# Altium project CompassIO_Project.PrjPcb
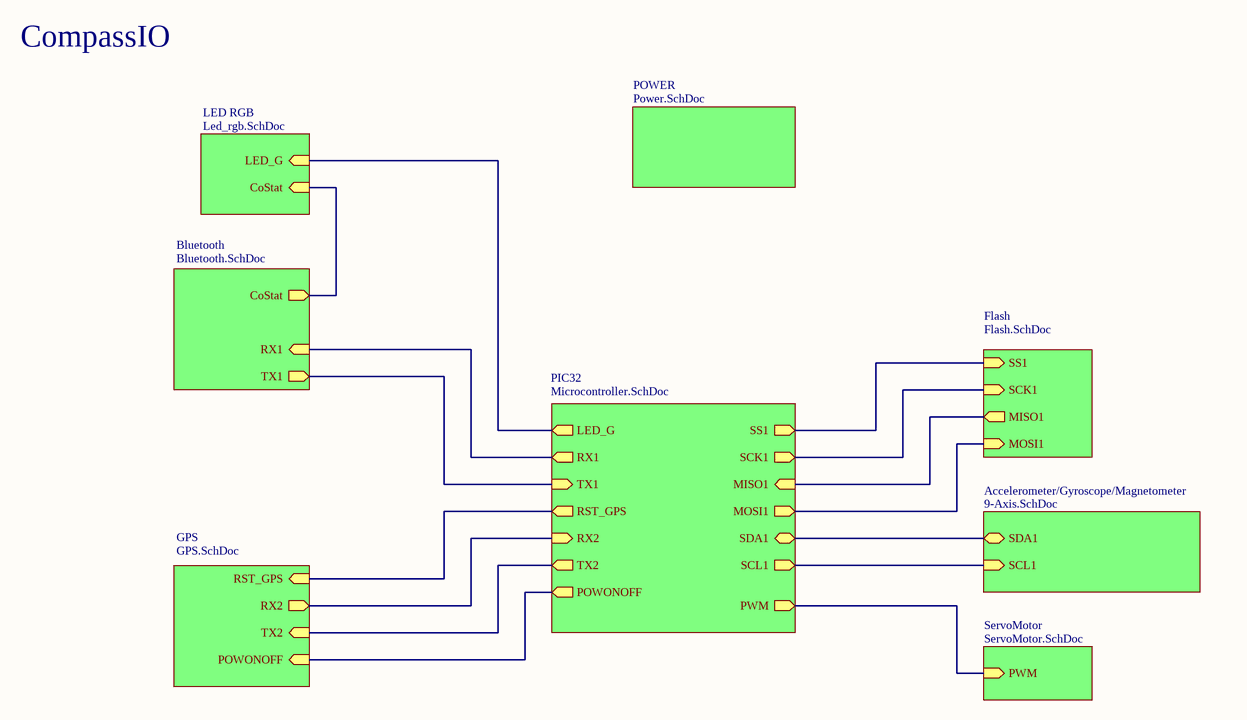
[diagram p0: CompassIO.SchDoc]
9 sheets, 70 parts. Net scope: hierarchical (ports join the sheet entries above them; power ports are global).
Board files: PCB1.PcbDoc, PCB2.PcbDoc
Sheets:
  CompassIO.SchDoc
    Bluetooth = Bluetooth.SchDoc
    PIC32 = Microcontroller.SchDoc
    GPS = GPS.SchDoc
    Accelerometer/Gyroscope/Magnetometer = 9-Axis.SchDoc
    Flash = Flash.SchDoc
    ServoMotor = ServoMotor.SchDoc
    LED RGB = Led_rgb.SchDoc
    POWER = Power.SchDoc

## Sheet CompassIO.SchDoc
size A4; SheetNumber: 0

### Sub-sheets
Accelerometer/Gyroscope/Magnetometer = 9-Axis.SchDoc: SDA1 (bidir), SCL1 (in)
Bluetooth = Bluetooth.SchDoc: CoStat (out), RX1 (in), TX1 (out)
Flash = Flash.SchDoc: SS1 (in), SCK1 (in), MISO1 (out), MOSI1 (in)
GPS = GPS.SchDoc: RST_GPS (in), TX2 (in), RX2 (out), POWONOFF (in)
LED RGB = Led_rgb.SchDoc: LED_G (in), CoStat (in)
PIC32 = Microcontroller.SchDoc: POWONOFF (out), RX2 (in), TX2 (out), RST_GPS (out), LED_G (out), RX1 (out), TX1 (in), SS1 (out), SCK1 (out), MISO1 (in), MOSI1 (out), SDA1 (bidir), PWM (out), SCL1 (out)
POWER = Power.SchDoc: no entries
ServoMotor = ServoMotor.SchDoc: PWM (in)

### Nets
NetJ1_13: sheet Bluetooth/TX1, sheet PIC32/TX1
NetJ1_14: sheet Bluetooth/RX1, sheet PIC32/RX1
NetJ1_21: sheet Bluetooth/CoStat, sheet LED RGB/CoStat
NetJ2_5: sheet PIC32/SCL1, sheet Accelerometer/Gyroscope/Magnetometer/SCL1
NetJ2_6: sheet PIC32/SDA1, sheet Accelerometer/Gyroscope/Magnetometer/SDA1
NetJ4_1: sheet PIC32/RST_GPS, sheet GPS/RST_GPS
NetJ4_18: sheet PIC32/POWONOFF, sheet GPS/POWONOFF
NetJ4_20: sheet PIC32/RX2, sheet GPS/RX2
NetJ4_21: sheet PIC32/TX2, sheet GPS/TX2
NetQ1_2: sheet PIC32/PWM, sheet ServoMotor/PWM
NetR9_2: sheet PIC32/LED_G, sheet LED RGB/LED_G
NetU1_22: sheet PIC32/MISO1, sheet Flash/MISO1
NetU1_24: sheet PIC32/MOSI1, sheet Flash/MOSI1
NetU1_25: sheet PIC32/SCK1, sheet Flash/SCK1
NetU1_26: sheet PIC32/SS1, sheet Flash/SS1

### Notes on the sheet
- CompassIO

## Sheet Bluetooth.SchDoc
size A4; SheetNumber: 3
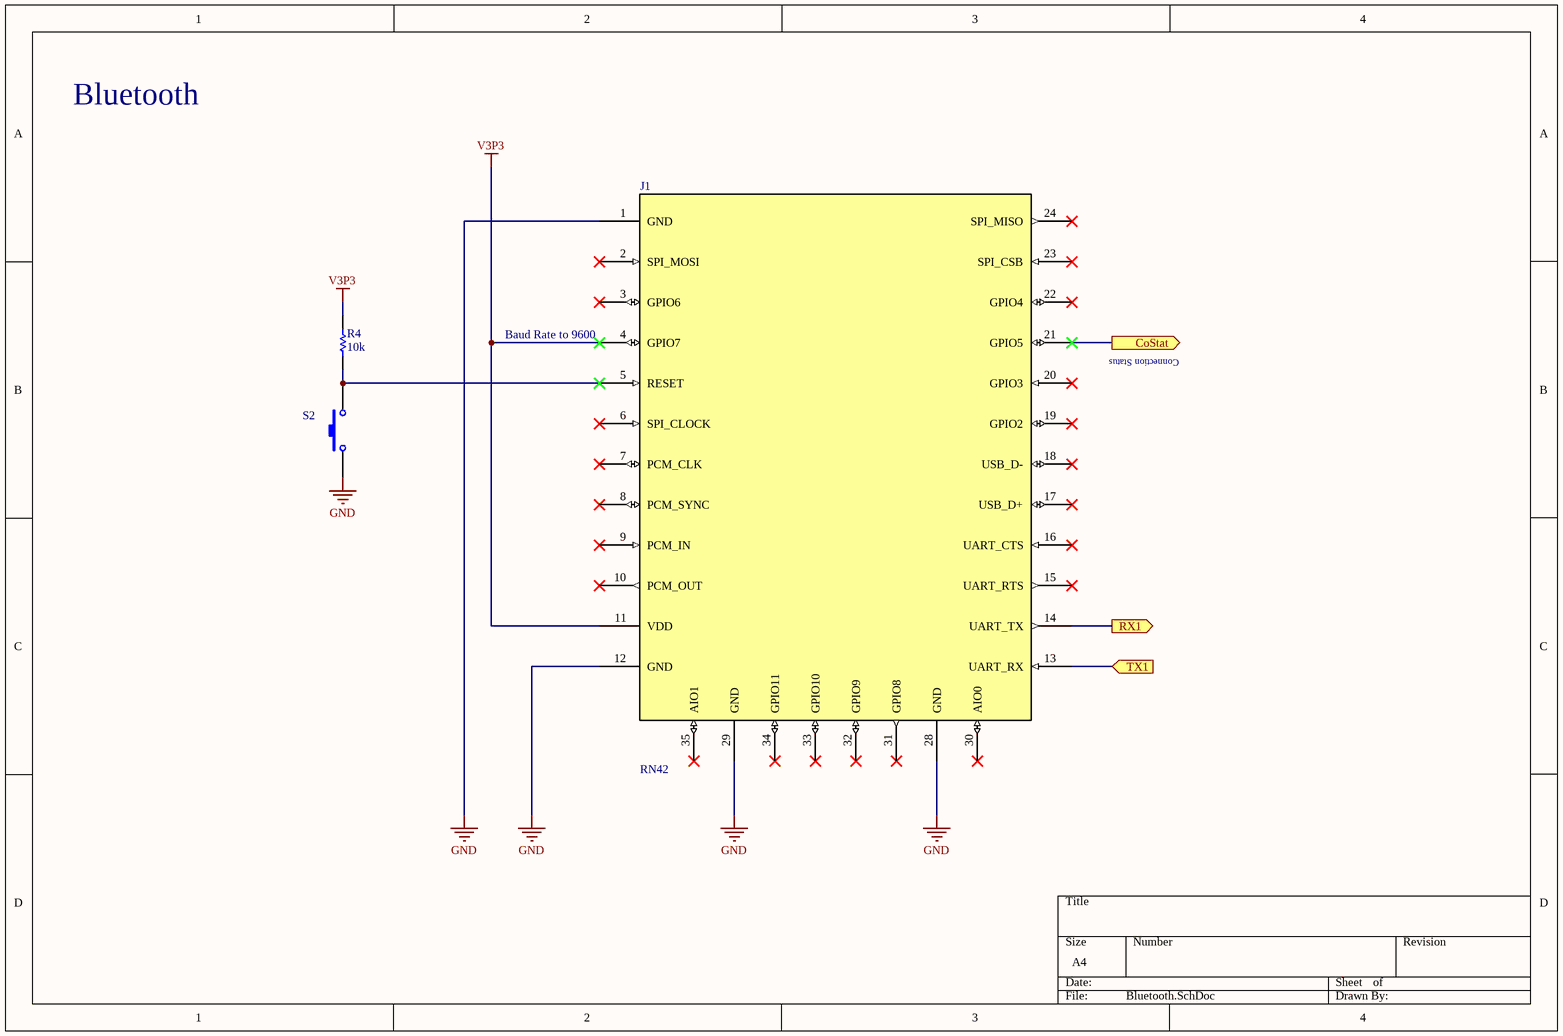
[diagram p1: Bluetooth.SchDoc]

### Parts
J1  RN42  [RN42]
R4  10k  [own_0603]
S2  Switch  [DPST-4]  (value not drawn)

### Ports
CoStat (out), RX1 (out), TX1 (in)

### Nets
GND: J1.1(GND) J1.12(GND) J1.28(GND) J1.29(GND) S2.1
V3P3: J1.4(GPIO7) J1.11(VDD) R4.2
NetJ1_5: J1.5(RESET) R4.1 S2.2
NetJ1_13: J1.13(UART_RX) ; port TX1
NetJ1_14: J1.14(UART_TX) ; port RX1
NetJ1_21: J1.21(GPIO5) ; port CoStat

Not connected (* = marked no-connect by the designer): J1 2(SPI_MOSI)* 3(GPIO6)* 6(SPI_CLOCK)* 7(PCM_CLK)* 8(PCM_SYNC)* 9(PCM_IN)* 10(PCM_OUT)* 15(UART_RTS)* 16(UART_CTS)* 17(USB_D+)* 18(USB_D-)* 19(GPIO2)* 20(GPIO3)* 22(GPIO4)* 23(SPI_CSB)* 24(SPI_MISO)* 30(AIO0)* 31(GPIO8)* 32(GPIO9)* 33(GPIO10)* 34(GPIO11)* 35(AIO1)*

### Notes on the sheet
- Bluetooth
- (near J1) Baud Rate to 9600
- Connection Status

### Library data of the parts
J1 = RN42: Bluetooth Module; Fabricant: Microchip; RefFabricant: RN42-I/RM; Fournisseur: Farnell; RefFournisseur: 2143310
R4 = Res1: Resistor; Published: 8-Jun-2000; LatestRevisionDate: 17-Jul-2002; LatestRevisionNote: Re-released for DXP Platform.; PackageReference: AXIAL-0.3; Publisher: Altium Limited; PackageDescription: Axial Device, Thru-Hole; 2 Leads; 0.3 in Pin Spacing
S2 = SW-PB: Reset; Published: 24-Mar-1999; LatestRevisionDate: 17-Jul-2002; LatestRevisionNote: Re-released for DXP Platform.; PackageReference: SPST-2; Publisher: Altium Limited; PackageDescription: Switch; 2 Leads

## Sheet Microcontroller.SchDoc
size A4; SheetNumber: 1
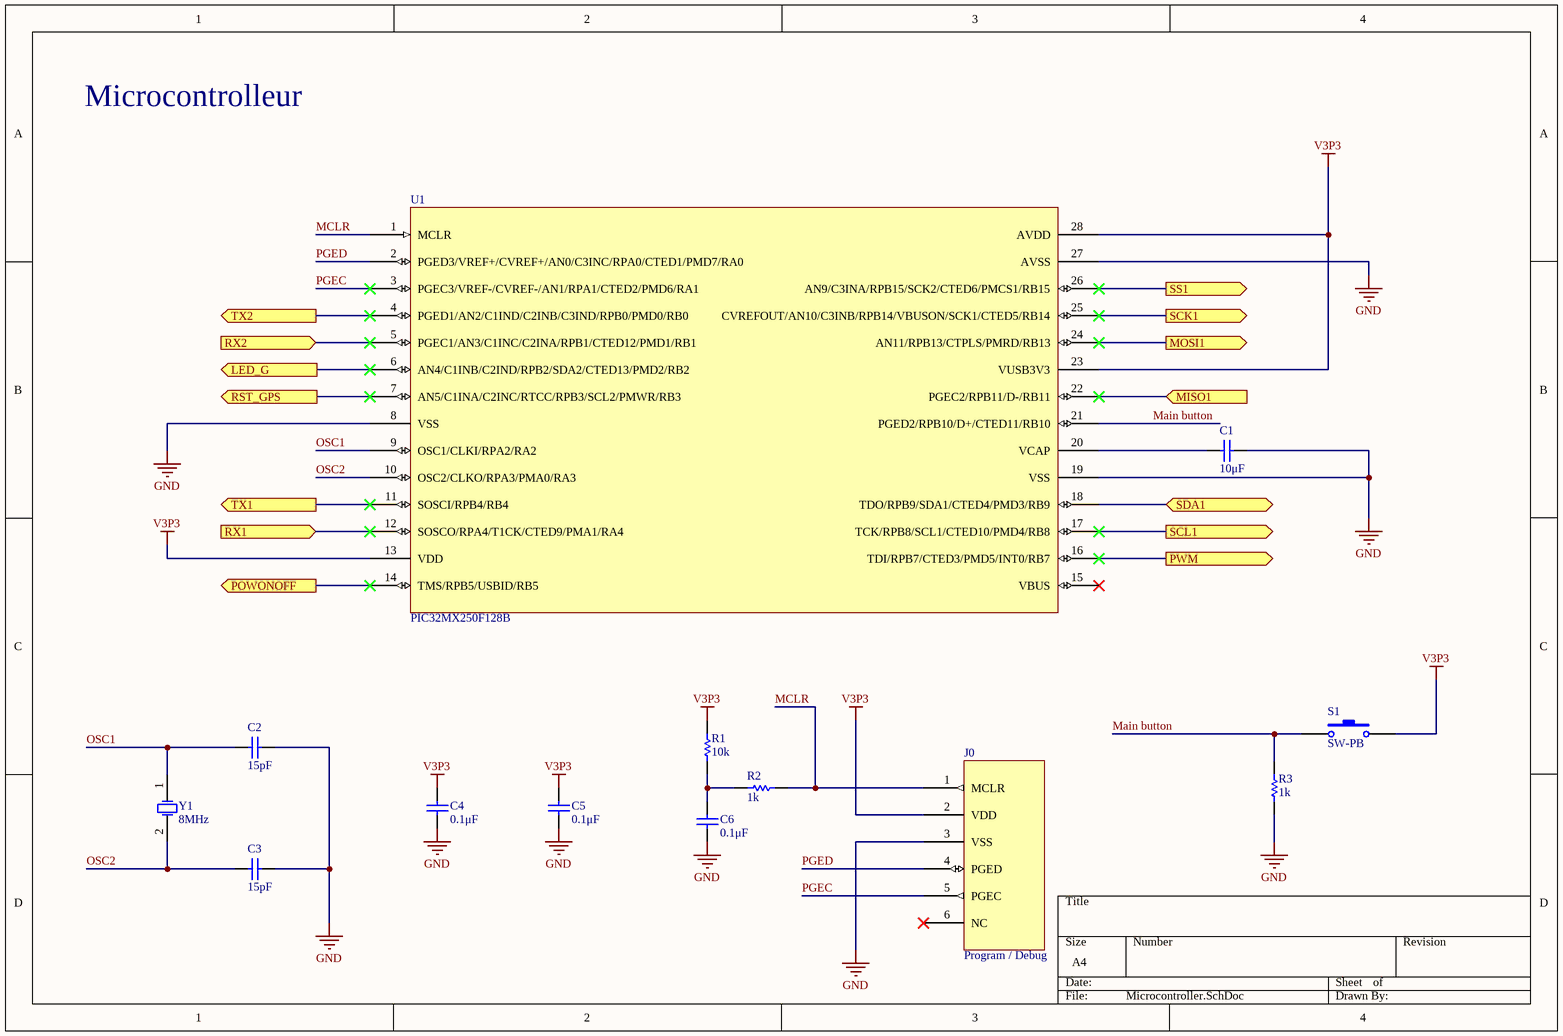
[diagram p2: Microcontroller.SchDoc]

### Parts
C1  10μF  [own_0603]
C2  15pF  [own_0603]
C3  15pF  [own_0603]
C4  0.1μF  [own_0603]
C5  0.1μF  [own_0603]
C6  0.1μF  [own_0603]
J0  Program / Debug  [C-Grid III X6]
R1  10k  [own_0603]
R2  1k  [own_0603]
R3  1k  [own_0603]
S1  SW-PB  [SPST-2]
U1  PIC32MX250F128B  [PIC32MX250F128/SO]
Y1  8MHz  [9B-8.000MAAJ-B]

### Ports
LED_G (out), MISO1 (in), MOSI1 (out), POWONOFF (out), PWM (out), RST_GPS (out), RX1 (in), RX2 (in), SCK1 (out), SCL1 (out), SDA1 (bidir), SS1 (out), TX1 (out), TX2 (out)

### Nets
GND: C1.1 C2.2 C3.2 C4.1 C5.1 C6.1 J0.3(VSS) R3.2 U1.8(VSS) U1.19(VSS) U1.27(AVSS)
V3P3: C4.2 C5.2 J0.2(VDD) R1.1 S1.2 U1.13(VDD) U1.23(VUSB3V3) U1.28(AVDD)
Main button: R3.1 S1.1 U1.21(PGED2/RPB10/D+/CTED11/RB10)
MCLR: J0.1(MCLR) R2.1 U1.1(MCLR)
OSC1: C2.1 U1.9(OSC1/CLKI/RPA2/RA2) Y1.1(OSC1)
OSC2: C3.1 U1.10(OSC2/CLKO/RPA3/PMA0/RA3) Y1.2(OSC2)
PGEC: J0.5(PGEC) U1.3(PGEC3/VREF-/CVREF-/AN1/RPA1/CTED2/PMD6/RA1)
PGED: J0.4(PGED) U1.2(PGED3/VREF+/CVREF+/AN0/C3INC/RPA0/CTED1/PMD7/RA0)
NetC1_2: C1.2 U1.20(VCAP)
NetC6_2: C6.2 R1.2 R2.2
NetJ1_13: U1.11(SOSCI/RPB4/RB4) ; port TX1
NetJ1_14: U1.12(SOSCO/RPA4/T1CK/CTED9/PMA1/RA4) ; port RX1
NetJ2_5: U1.17(TCK/RPB8/SCL1/CTED10/PMD4/RB8) ; port SCL1
NetJ2_6: U1.18(TDO/RPB9/SDA1/CTED4/PMD3/RB9) ; port SDA1
NetJ4_1: U1.7(AN5/C1INA/C2INC/RTCC/RPB3/SCL2/PMWR/RB3) ; port RST_GPS
NetJ4_18: U1.14(TMS/RPB5/USBID/RB5) ; port POWONOFF
NetJ4_20: U1.5(PGEC1/AN3/C1INC/C2INA/RPB1/CTED12/PMD1/RB1) ; port RX2
NetJ4_21: U1.4(PGED1/AN2/C1IND/C2INB/C3IND/RPB0/PMD0/RB0) ; port TX2
NetQ1_2: U1.16(TDI/RPB7/CTED3/PMD5/INT0/RB7) ; port PWM
NetR9_2: U1.6(AN4/C1INB/C2IND/RPB2/SDA2/CTED13/PMD2/RB2) ; port LED_G
NetU1_22: U1.22(PGEC2/RPB11/D-/RB11) ; port MISO1
NetU1_24: U1.24(AN11/RPB13/CTPLS/PMRD/RB13) ; port MOSI1
NetU1_25: U1.25(CVREFOUT/AN10/C3INB/RPB14/VBUSON/SCK1/CTED5/RB14) ; port SCK1
NetU1_26: U1.26(AN9/C3INA/RPB15/SCK2/CTED6/PMCS1/RB15) ; port SS1

Not connected (* = marked no-connect by the designer): J0 6(NC)*; U1 15(VBUS)*

### Notes on the sheet
- Microcontrolleur

### Library data of the parts
C1-C6 = Cap: Capacitor; Published: 8-Jun-2000; LatestRevisionDate: 17-Jul-2002; LatestRevisionNote: Re-released for DXP Platform.; PackageReference: RAD-0.3; Publisher: Altium Limited; PackageDescription: Radial Cap, Thru-Hole; 2 Leads; 0.3 in Pin Spacing
  C1: Value: 10μF
  C2 C3: Value: 15pF
  C4-C6: Value: 0.1μF
J0 = ICSP: Fabricant: Molex; RefFabricant: 90120-0126; Fournisseur: Farnell; RefFournisseur: 2313717
R1-R3 = Res1: Resistor; Published: 8-Jun-2000; LatestRevisionDate: 17-Jul-2002; LatestRevisionNote: Re-released for DXP Platform.; PackageReference: AXIAL-0.3; Publisher: Altium Limited; PackageDescription: Axial Device, Thru-Hole; 2 Leads; 0.3 in Pin Spacing
  R1: Value: 10k
  R2 R3: Value: 1k
S1 = SW-PB: Switch
U1 = PIC32MX250F128B: Microcontrolleur; Fabricant: Microchip; RefFabricant: PIC32MX250F128B-I/SO; Fournisseur: Farnell; RefFournisseur: 2097772
Y1 = XTAL: Crystal Oscillator; Fabricant: TXC; Fournisseur: Farnell; RefFournisseur: 1842268; RefFabricant: 9B-8.000MAAJ-B

## Sheet GPS.SchDoc
size A4; SheetNumber: 4
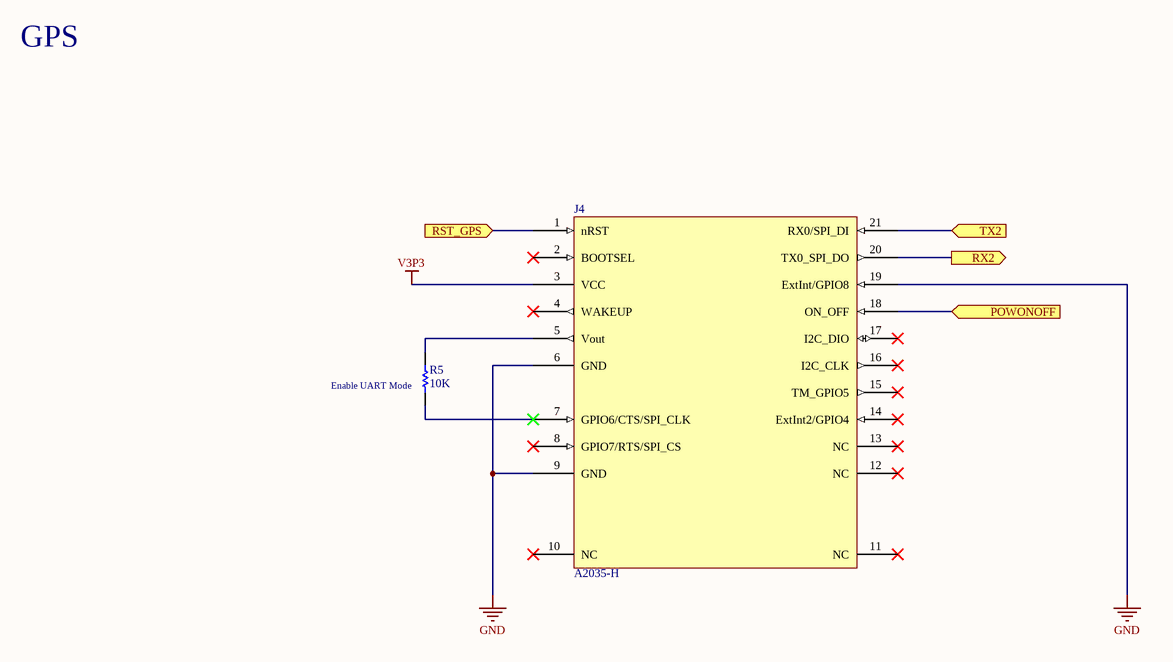
[diagram p3: GPS.SchDoc]

### Parts
J4  A2035-H  [A2035-H]
R5  10K  [own_0603]

### Ports
POWONOFF (in), RST_GPS (in), RX2 (out), TX2 (in)

### Nets
GND: J4.6(GND) J4.9(GND) J4.19(ExtInt/GPIO8)
V3P3: J4.3(VCC)
NetJ4_1: J4.1(nRST) ; port RST_GPS
NetJ4_5: J4.5(Vout) R5.2
NetJ4_7: J4.7(GPIO6/CTS/SPI_CLK) R5.1
NetJ4_18: J4.18(ON_OFF) ; port POWONOFF
NetJ4_20: J4.20(TX0_SPI_DO) ; port RX2
NetJ4_21: J4.21(RX0/SPI_DI) ; port TX2

Not connected (* = marked no-connect by the designer): J4 2(BOOTSEL)* 4(WAKEUP)* 8(GPIO7/RTS/SPI_CS)* 10(NC)* 11(NC)* 12(NC)* 13(NC)* 14(ExtInt2/GPIO4)* 15(TM_GPIO5)* 16(I2C_CLK)* 17(I2C_DIO)*

### Notes on the sheet
- GPS
- (near R5) Enable UART Mode

### Library data of the parts
J4 = A2035-H: GPS Module; Fabricant: MAESTRO WIRELESS SOLUTIONS; RefFabricant: A2035H; Fournisseur: Farnell; RefFournisseur: 2281693
R5 = Res1: Resistor; Published: 8-Jun-2000; LatestRevisionDate: 17-Jul-2002; LatestRevisionNote: Re-released for DXP Platform.; PackageReference: AXIAL-0.3; Publisher: Altium Limited; PackageDescription: Axial Device, Thru-Hole; 2 Leads; 0.3 in Pin Spacing

## Sheet 9-Axis.SchDoc
size A4; SheetNumber: 2
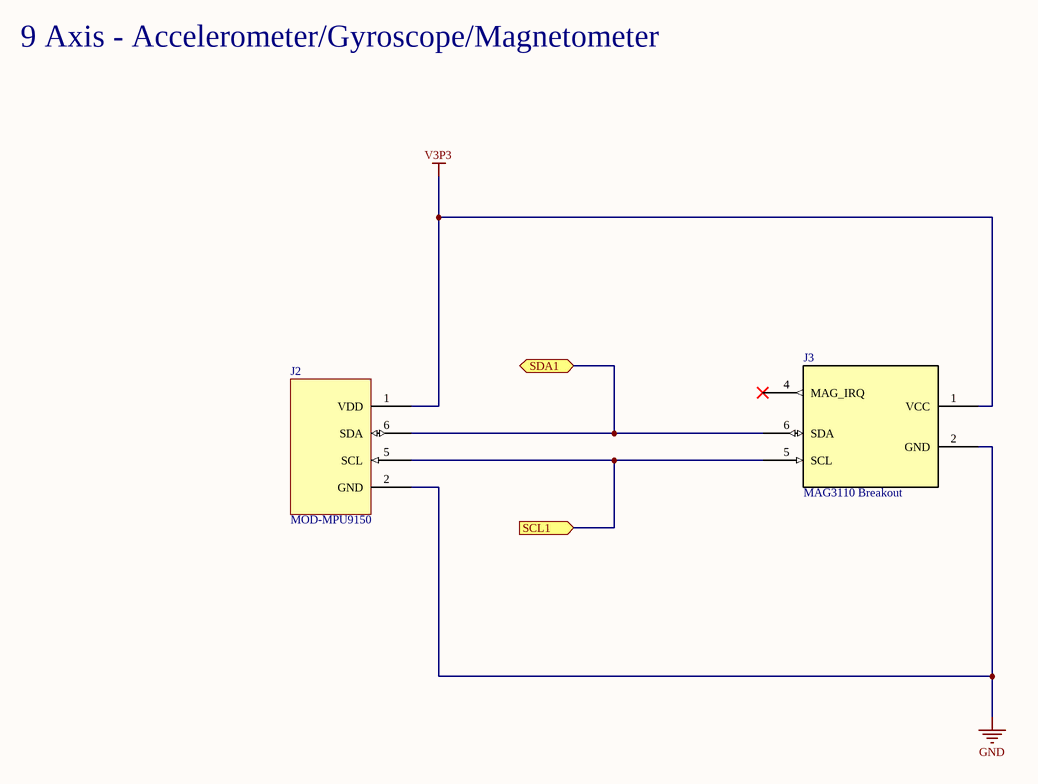
[diagram p4: 9-Axis.SchDoc]

### Parts
J2  MOD-MPU9150  [UEXT_MALE x10]
J3  MAG3110 Breakout  [UEXT_MALE x10]

### Ports
SCL1 (in), SDA1 (bidir)

### Nets
GND: J2.2(GND) J3.2(GND)
V3P3: J2.1(VDD) J3.1(VCC)
NetJ2_5: J2.5(SCL) J3.5(SCL) ; port SCL1
NetJ2_6: J2.6(SDA) J3.6(SDA) ; port SDA1

Not connected (* = marked no-connect by the designer): J3 4(MAG_IRQ)*

### Notes on the sheet
- 9 Axis - Accelerometer/Gyroscope/Magnetometer

### Library data of the parts
J2 = MOD-MPU9150: 9-Axis; Fabricant: AMP - TE Connectivy; RefFabricant: 5103310-1; Fournisseur: Farnell; RefFournisseur: 2452436
J3 = MOD-MAG3110: Fournisseur: Farnell; RefFabricant: 5103310-1; Fabricant: AMP - TE Connectvity; RefFournisseur: 2452436

## Sheet Flash.SchDoc
size A4; SheetNumber: 5
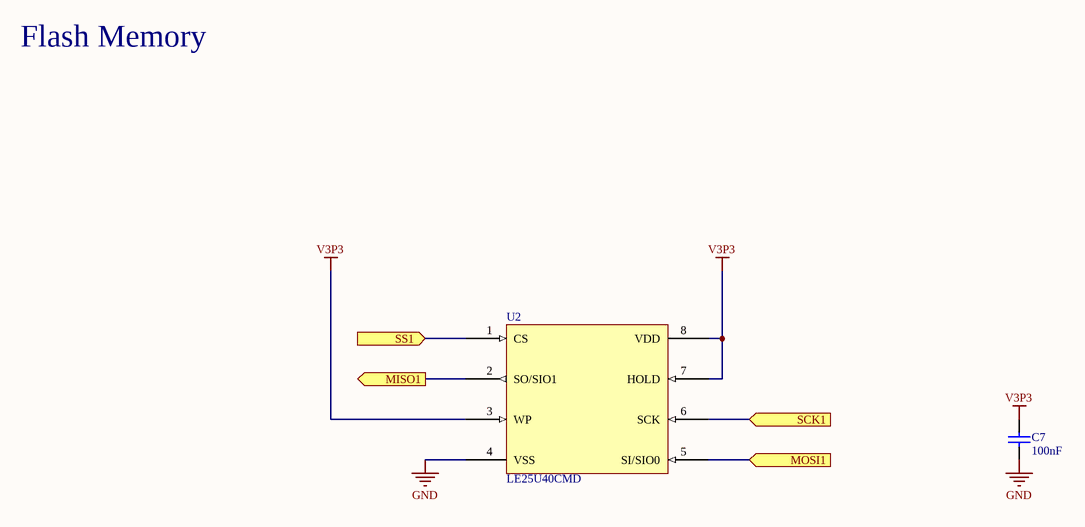
[diagram p5: Flash.SchDoc]

### Parts
C7  100nF  [own_0603]
U2  LE25U40CMD  [LE25U40CMDTWG]

### Ports
MISO1 (out), MOSI1 (in), SCK1 (in), SS1 (in)

### Nets
GND: C7.1 U2.4(VSS)
V3P3: C7.2 U2.3(WP) U2.7(HOLD) U2.8(VDD)
NetU1_22: U2.2(SO/SIO1) ; port MISO1
NetU1_24: U2.5(SI/SIO0) ; port MOSI1
NetU1_25: U2.6(SCK) ; port SCK1
NetU1_26: U2.1(CS) ; port SS1

### Notes on the sheet
- Flash Memory

### Library data of the parts
C7 = Cap: Capacitor; Value: 100pF; Published: 8-Jun-2000; LatestRevisionDate: 17-Jul-2002; LatestRevisionNote: Re-released for DXP Platform.; PackageReference: RAD-0.3; Publisher: Altium Limited; PackageDescription: Radial Cap, Thru-Hole; 2 Leads; 0.3 in Pin Spacing
U2 = LE25U40CMD: Flash memory; Fabricant: On Semiconductor; Fournisseur: Farnell; RefFournisseur: 2627898; RefFabricant: LE25U40CMDTWG

## Sheet ServoMotor.SchDoc
size A4; SheetNumber: 7
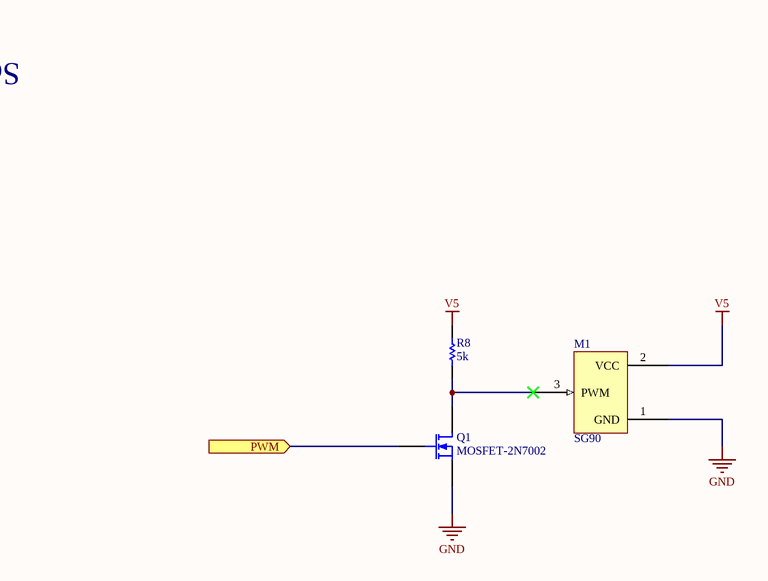
[diagram p6: ServoMotor.SchDoc]

### Parts
M1  SG90  [C-Grid III x3]
Q1  MOSFET-2N7002  [2N7002]
R8  5k  [own_0603]

### Ports
PWM (in)

### Nets
GND: M1.1(GND) Q1.3(S)
V5: M1.2(VCC) R8.2
NetM1_3: M1.3(PWM) Q1.1(D) R8.1
NetQ1_2: Q1.2(G) ; port PWM

### Notes on the sheet
- Servomotor

### Library data of the parts
M1 = SG90: Servo motor; Fabricant: Molex; Fournisseur: Farnell; RefFournisseur: 9731156; RefFabricant: 22-27-2031
Q1 = MOSFET-N: N-Channel MOSFET; Fabricant: ON SEMICONDUCTOR; Fournisseur: Farnell; RefFournisseur: 9845313; RefFabricant: 2N7002
R8 = Res1: Resistor; Published: 8-Jun-2000; LatestRevisionDate: 17-Jul-2002; LatestRevisionNote: Re-released for DXP Platform.; PackageReference: AXIAL-0.3; Publisher: Altium Limited; PackageDescription: Axial Device, Thru-Hole; 2 Leads; 0.3 in Pin Spacing

## Sheet Led_rgb.SchDoc
size A4; SheetNumber: 6
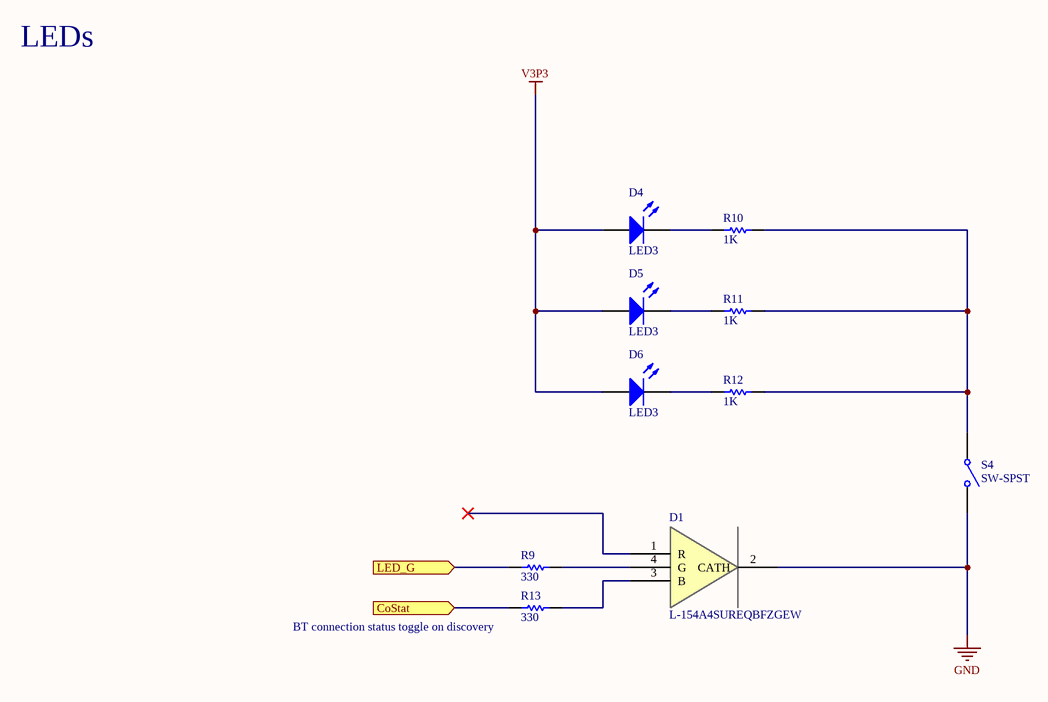
[diagram p7: Led_rgb.SchDoc]

### Parts
D1  L-154A4SUREQBFZGEW  [L-154A4SUREQBFZGEW]
D4  LED3  [LED2.5]
D5  LED3  [LED2.5]
D6  LED3  [LED2.5]
R9  330  [own_0603]
R10  1K  [own_0603]
R11  1K  [own_0603]
R12  1K  [own_0603]
R13  330  [own_0603]
S4  SW-SPST  [SPST-2]

### Ports
CoStat (in), LED_G (in)

### Nets
GND: D1.2(CATH) S4.2(NO)
V3P3: D4.1(A) D5.1(A) D6.1(A)
NetD1_3: D1.3(B) R13.1
NetD1_4: D1.4(G) R9.1
NetD4_2: D4.2(K) R10.1
NetD5_2: D5.2(K) R11.1
NetD6_2: D6.2(K) R12.1
NetJ1_21: R13.2 ; port CoStat
NetR9_2: R9.2 ; port LED_G
NetR10_2: R10.2 R11.2 R12.2 S4.1(COMMON)

Not connected (* = marked no-connect by the designer): D1 1(R)*

### Notes on the sheet
- LEDs
- (near R13) BT connection status toggle on discovery

### Library data of the parts
D1 = L-154A4SUREQBFZGEW: LED RGB; Fabricant: Kingbright; Fournisseur: Farnell; RefFournisseur: 2290375; RefFabricant: L-154A4SUREQBFZGEW
D4-D6 = LED3: Typical BLUE SiC LED; Fabricant: MULTICOMP; RefFabricant: MCL034SWC-WH1; Fournisseur: Farnell; RefFournisseur: 1581176
R9-R13 = Res1: Resistor; Published: 8-Jun-2000; LatestRevisionDate: 17-Jul-2002; LatestRevisionNote: Re-released for DXP Platform.; PackageReference: AXIAL-0.3; Publisher: Altium Limited; PackageDescription: Axial Device, Thru-Hole; 2 Leads; 0.3 in Pin Spacing
  R9 R13: Value: 330
  R10-R12: Value: 1K
S4 = SW-SPST: Single-Pole, Single-Throw Switch

## Sheet Power.SchDoc
size A4; SheetNumber: 8
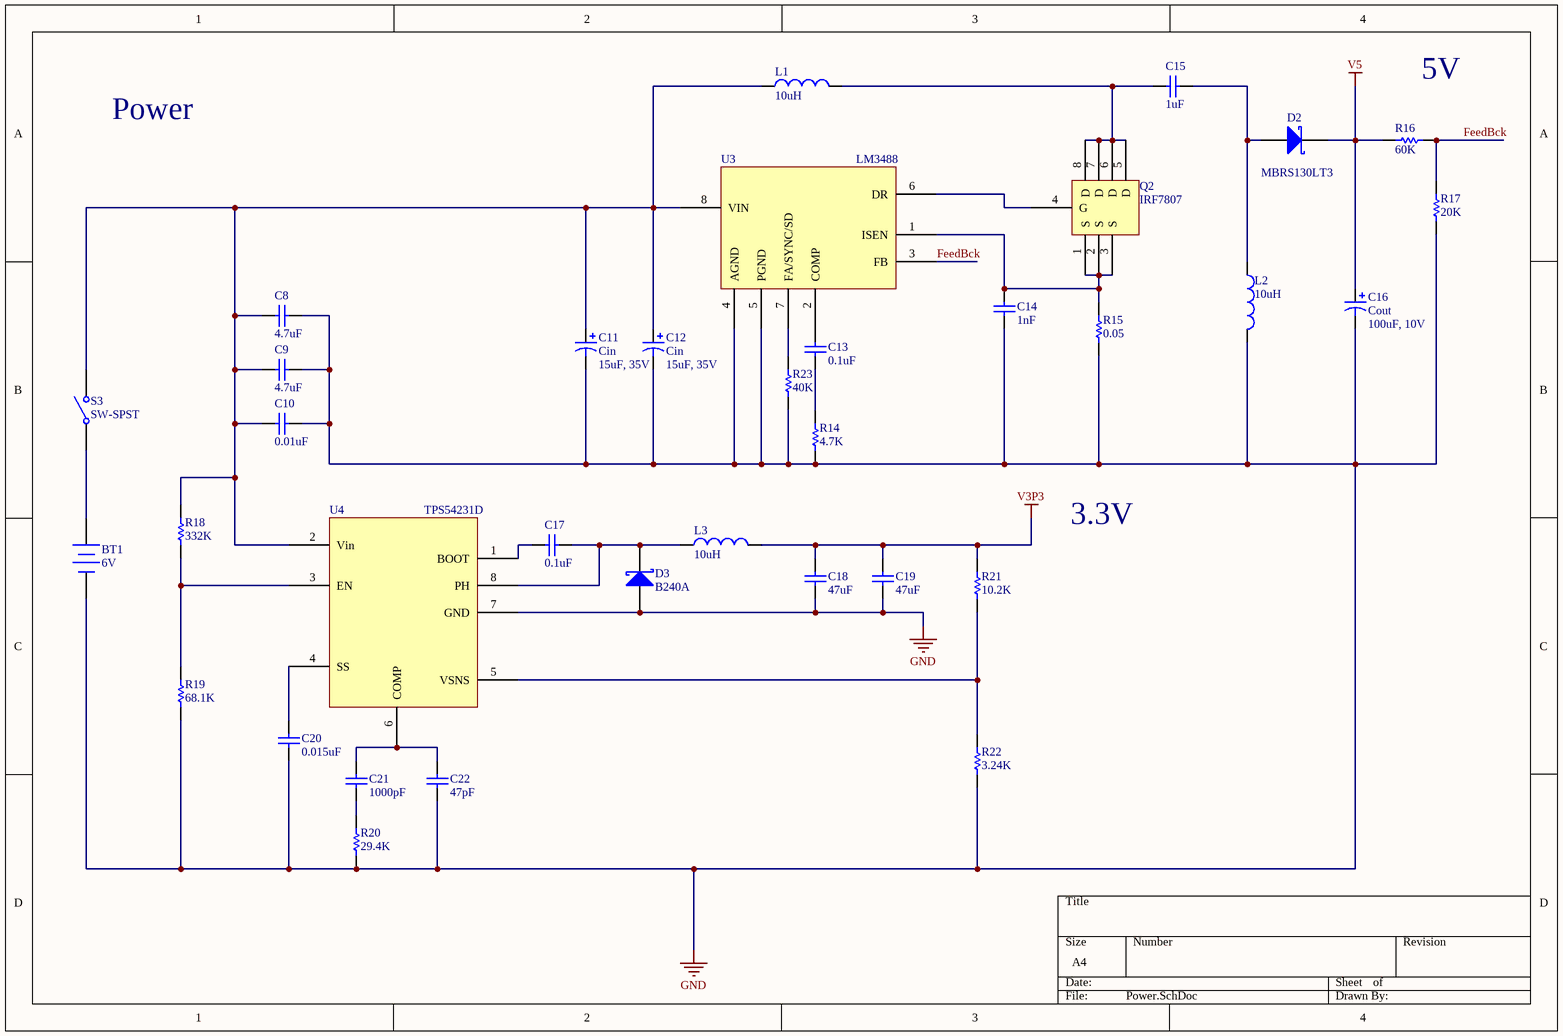
[diagram p8: Power.SchDoc]

### Parts
BT1  6V  [BAT-2]
C8  4.7uF  [own_0603]
C9  4.7uF  [own_0603]
C10  0.01uF  [own_0603]
C11  Cin  value 15uF, 35V  [WE-865080542005]
C12  Cin  value 15uF, 35V  [WE-865080542005]
C13  0.1uF  [own_0603]
C14  1nF  [own_0603]
C15  1uF  [own_0603]
C16  Cout  value 100uF, 10V  [SMT-HA-V-D]
C17  0.1uF  [own_0603]
C18  47uF  [own_0603]
C19  47uF  [own_0603]
C20  0.015uF  [own_0603]
C21  1000pF  [own_0603]
C22  47pF  [own_0603]
D2  MBRS130LT3  [SMB-403A-03-J]
D3  B240A  [SMA-B2XX/A]
L1  10uH  [RLB Series]
L2  10uH  [RLB Series]
L3  10uH  [RLB Series]
Q2  IRF7807  [SO-8]
R14  4.7K  [own_0603]
R15  0.05  [own_0603]
R16  60K  [own_0603]
R17  20K  [own_0603]
R18  332K  [own_0603]
R19  68.1K  [own_0603]
R20  29.4K  [own_0603]
R21  10.2K  [own_0603]
R22  3.24K  [own_0603]
R23  40K  [own_0603]
S3  SW-SPST  [SPST-2]
U3  LM3488  [S-PDSO-G8]
U4  TPS54231D  [R-PDSO-G8]

### Nets
GND: BT1.2(-) C8.2 C9.2 C10.2 C11.2 C12.2 C14.1 C16.2 C18.1 C19.1 C20.1 C22.1 D3.2(A) L2.2 R14.1 R15.1 R17.2 R19.2 R20.2 R22.2 R23.2 U3.4(AGND) U3.5(PGND) U4.7(GND)
V3P3: C18.2 C19.2 L3.2 R21.1
V5: C16.1 D2.1(K) R16.2
FeedBck: R16.1 R17.1 U3.3(FB)
NetBT1_1: BT1.1(+) S3.1(COMMON)
NetC8_1: C8.1 C9.1 C10.1 C11.1 C12.1 L1.1 R18.1 S3.2(NO) U3.8(VIN) U4.2(Vin)
NetC13_1: C13.1 R14.2
NetC13_2: C13.2 U3.2(COMP)
NetC14_2: C14.2 Q2.1(S) Q2.2(S) Q2.3(S) R15.2 U3.1(ISEN)
NetC15_1: C15.1 D2.2(A) L2.1
NetC15_2: C15.2 L1.2 Q2.5(D) Q2.6(D) Q2.7(D) Q2.8(D)
NetC17_1: C17.1 D3.1(K) L3.1 U4.8(PH)
NetC17_2: C17.2 U4.1(BOOT)
NetC20_2: C20.2 U4.4(SS)
NetC21_1: C21.1 R20.1
NetC21_2: C21.2 C22.2 U4.6(COMP)
NetQ2_4: Q2.4(G) U3.6(DR)
NetR18_2: R18.2 R19.1 U4.3(EN)
NetR21_2: R21.2 R22.1 U4.5(VSNS)
NetR23_1: R23.1 U3.7(FA/SYNC/SD)

### Notes on the sheet
- (near R16) 5V
- Power
- 3.3V

### Library data of the parts
BT1 = Battery: 4xAA
C8-C10 C13-C15 C17-C22 = Cap: Capacitor
  C8 C9: Value: 4.7uF
  C10: Value: 0.01uF
  C13 C17: Value: 0.1uF
  C14: Value: 1nF
  C15: Value: 1uF
  C18 C19: Value: 47uF
  C20: Value: 0.015uF
  C21: Value: 1000pF
  C22: Value: 47pF
C11 C12 = Cap Pol1: Polarized Capacitor (Radial); Fabricant: WURTH ELEKTRONIK; Fournisseur: Farnell; RefFabricant: 865080542005; RefFournisseur: 2466314
C16 = Cap Pol1: Polarized Capacitor (Radial); Fabricant: PANASONIC ELECTRONIC COMPONENTS; Fournisseur: Farnell; RefFabricant: EEEHA1A101WP; RefFournisseur: 1973294
D2 = Diode 10TQ035: Schottky Rectifier; Fabricant: ON SEMICONDUCTOR; Fournisseur: Farnell; RefFabricant: MBRS130LT3G; RefFournisseur: 9556931
D3 = Diode 10TQ035: Schottky Rectifier; Fabricant: DIODES INC.; Fournisseur: Farnell; RefFabricant: B240A-13-F; RefFournisseur: 1843669
L1-L3 = Inductor: Fabricant: BOURNS; RefFabricant: RLB0712-100KL; Fournisseur: Farnell; RefFournisseur: 2434811; Value: 10uH
Q2 = IRF7807: MOSFET-8; Fabricant: INFINEON; RefFabricant: IRF7807VTRPBF; Fournisseur: Farnell; RefFournisseur: 2839485
R14-R23 = Res1: Resistor
  R14: Value: 4.7K
  R15: Value: 0.05
  R16: Value: 60K
  R17: Value: 20K
  R18: Value: 332K
  R19: Value: 68.1K
  R20: Value: 29.4K
  R21: Value: 10.2K
  R22: Value: 3.24K
  R23: Value: 40K
S3 = SW-SPST: Single-Pole, Single-Throw Switch; RefFabricant: H8600VBAAA; Fabricant: Arcolectric; Fournisseur: Farnell; RefFournisseur: 151133
U3 = LM3488: SEPIC 5V; Fabricant: Texas Instruments; RefFabricant: LM3488MMX/NOPB; Fournisseur: Farnell; RefFournisseur: 2769264
U4 = TPS54231D: Buck SD 3.3V; Fabricant: Texas Instruments; Fournisseur: Farnell; RefFournisseur: 1755637; RefFabricant: TPS54231D

## Nets that join several sheets
GND: Bluetooth (5 pins), Microcontroller (11 pins), GPS (J4.6 J4.9 J4.19), 9-Axis (J2.2 J3.2), Flash (C7.1 U2.4), ServoMotor (M1.1 Q1.3), Led_rgb (D1.2 S4.2), Power (24 pins)
V3P3: Bluetooth (J1.4 J1.11 R4.2), Microcontroller (8 pins), GPS (J4.3), 9-Axis (J2.1 J3.1), Flash (C7.2 U2.3 U2.7 U2.8), Led_rgb (D4.1 D5.1 D6.1), Power (C18.2 C19.2 L3.2 R21.1)
V5: ServoMotor (M1.2 R8.2), Power (C16.1 D2.1 R16.2)
NetJ1_13: Bluetooth (J1.13), Microcontroller (U1.11)
NetJ1_14: Bluetooth (J1.14), Microcontroller (U1.12)
NetJ1_21: Bluetooth (J1.21), Led_rgb (R13.2)
NetJ2_5: Microcontroller (U1.17), 9-Axis (J2.5 J3.5)
NetJ2_6: Microcontroller (U1.18), 9-Axis (J2.6 J3.6)
NetJ4_1: Microcontroller (U1.7), GPS (J4.1)
NetJ4_18: Microcontroller (U1.14), GPS (J4.18)
NetJ4_20: Microcontroller (U1.5), GPS (J4.20)
NetJ4_21: Microcontroller (U1.4), GPS (J4.21)
NetQ1_2: Microcontroller (U1.16), ServoMotor (Q1.2)
NetR9_2: Microcontroller (U1.6), Led_rgb (R9.2)
NetU1_22: Microcontroller (U1.22), Flash (U2.2)
NetU1_24: Microcontroller (U1.24), Flash (U2.5)
NetU1_25: Microcontroller (U1.25), Flash (U2.6)
NetU1_26: Microcontroller (U1.26), Flash (U2.1)